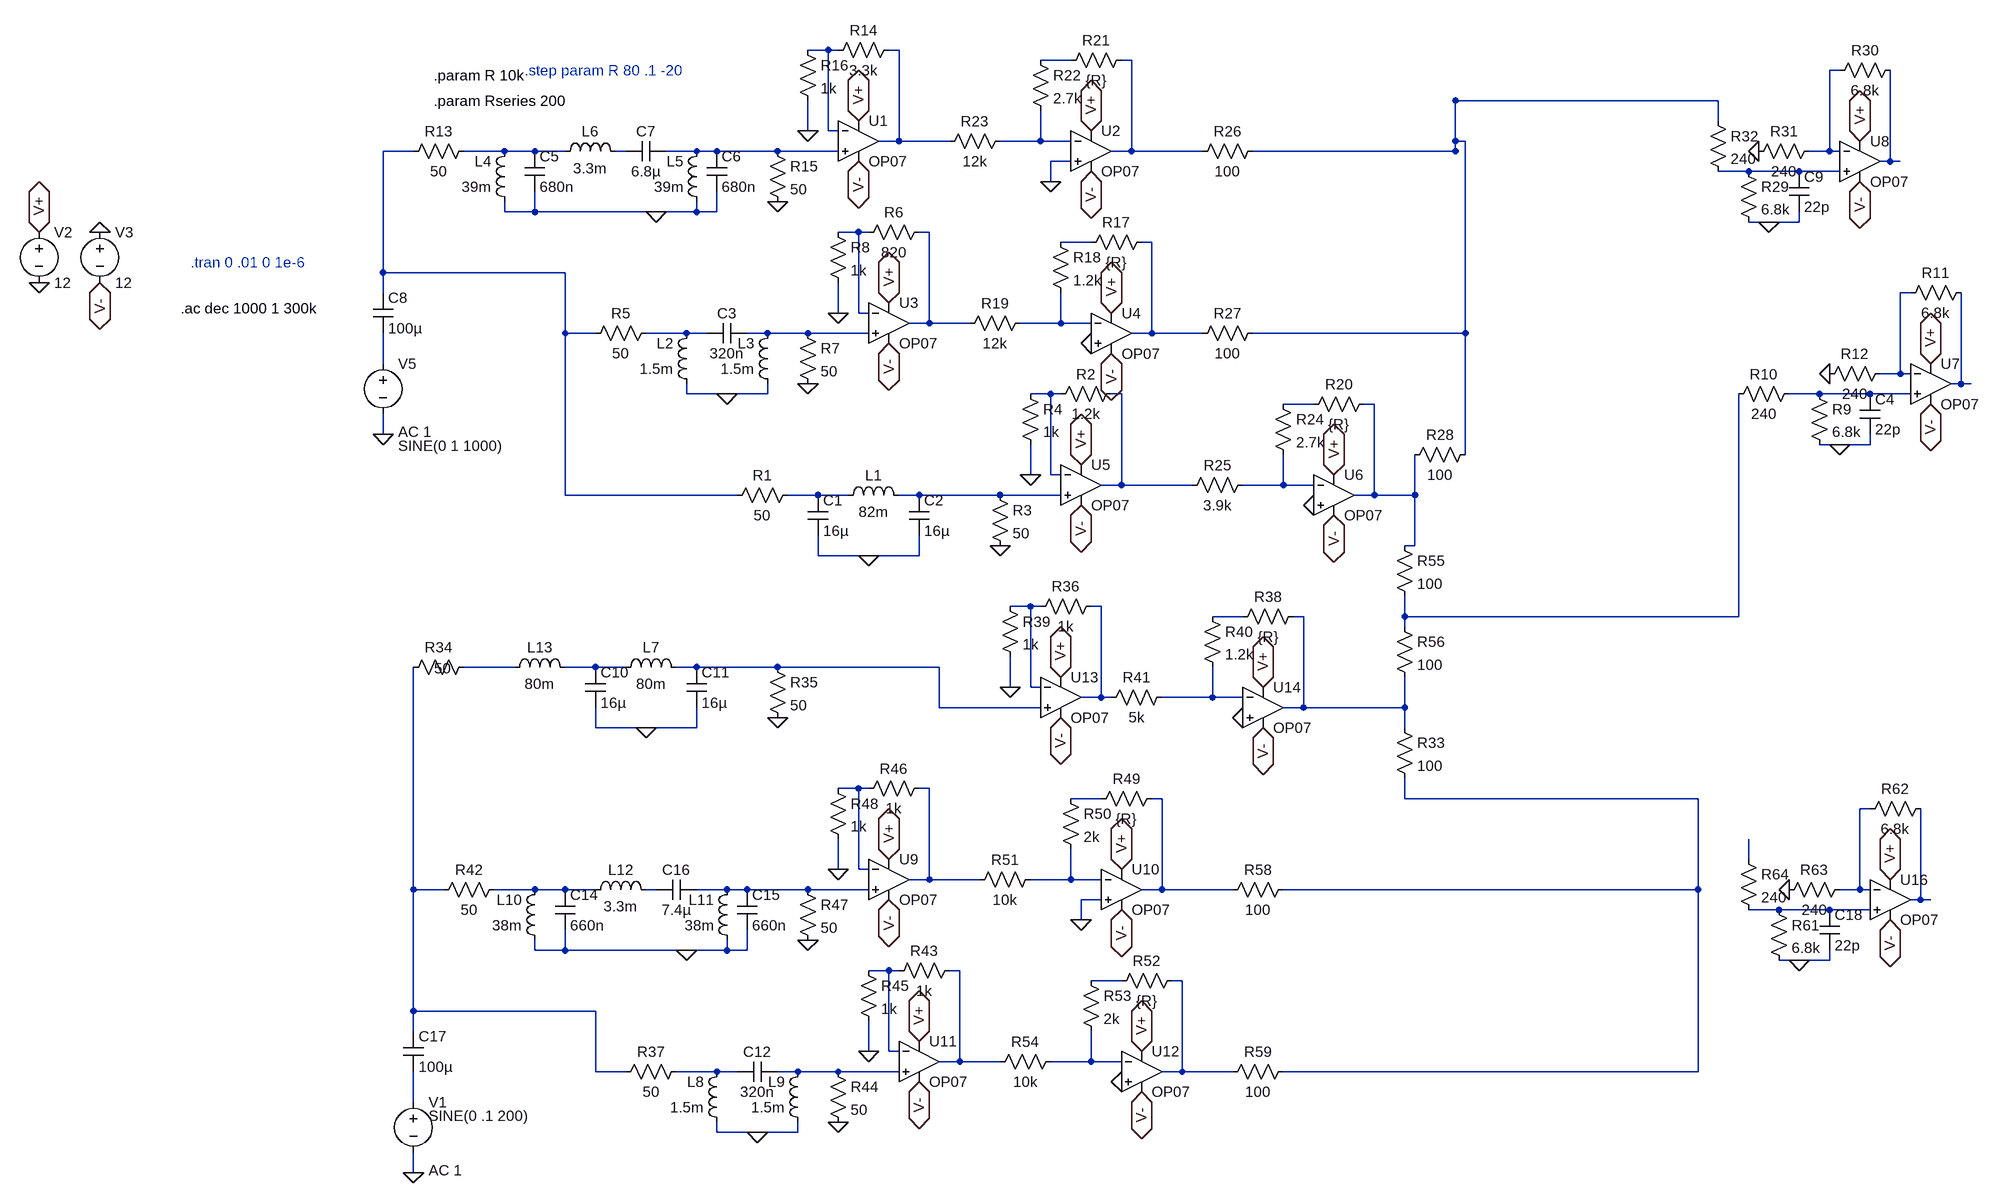
[diagram p0: schematic use_this_for_simulations_on_Mac_test_doubleBASS.asc]
use_this_for_simulations_on_Mac_test_doubleBASS.asc, the LTspice schematic file:
Version 4
SHEET 1 1632 1392
WIRE -192 -592 -224 -592
WIRE -176 -592 -192 -592
WIRE -80 -592 -96 -592
WIRE 192 -576 144 -576
WIRE 288 -576 272 -576
WIRE 1408 -560 1392 -560
WIRE 1216 -512 800 -512
WIRE 1216 -480 1216 -512
WIRE -224 -464 -224 -512
WIRE -192 -464 -192 -592
WIRE -176 -464 -192 -464
WIRE -80 -448 -80 -592
WIRE -80 -448 -112 -448
WIRE 0 -448 -80 -448
WIRE 144 -448 144 -496
WIRE 144 -448 80 -448
WIRE 192 -448 144 -448
WIRE 800 -448 800 -512
WIRE 816 -448 800 -448
WIRE -848 -432 -896 -432
WIRE -704 -432 -768 -432
WIRE -656 -432 -704 -432
WIRE -608 -432 -656 -432
WIRE -512 -432 -528 -432
WIRE -400 -432 -448 -432
WIRE -368 -432 -400 -432
WIRE -272 -432 -368 -432
WIRE -176 -432 -272 -432
WIRE 288 -432 288 -576
WIRE 288 -432 256 -432
WIRE 400 -432 288 -432
<<<<<<< Updated upstream
WIRE 800 -432 800 -448
=======
WIRE 800 -432 800 -512
>>>>>>> Stashed changes
WIRE 800 -432 480 -432
WIRE 1392 -432 1392 -560
WIRE 1392 -432 1360 -432
WIRE 1408 -432 1392 -432
WIRE 192 -416 160 -416
WIRE 1488 -416 1488 -560
WIRE 1488 -416 1472 -416
WIRE 1504 -416 1488 -416
WIRE 1264 -400 1216 -400
WIRE 1344 -400 1264 -400
WIRE 1408 -400 1344 -400
WIRE 160 -384 160 -416
WIRE -704 -336 -704 -352
WIRE -656 -336 -656 -368
WIRE -656 -336 -704 -336
WIRE -464 -336 -656 -336
WIRE -400 -336 -400 -352
WIRE -400 -336 -464 -336
WIRE -368 -336 -368 -368
WIRE -368 -336 -400 -336
WIRE 1296 -320 1264 -320
WIRE 1344 -320 1344 -336
WIRE 1344 -320 1296 -320
WIRE -144 -304 -176 -304
WIRE -128 -304 -144 -304
WIRE -32 -304 -48 -304
WIRE 224 -288 176 -288
WIRE 320 -288 304 -288
WIRE -896 -240 -896 -432
WIRE -608 -240 -896 -240
WIRE -896 -208 -896 -240
WIRE 1520 -208 1504 -208
WIRE -176 -176 -176 -224
WIRE -144 -176 -144 -304
WIRE -128 -176 -144 -176
WIRE -32 -160 -32 -304
WIRE -32 -160 -64 -160
WIRE 32 -160 -32 -160
WIRE 176 -160 176 -208
WIRE 176 -160 112 -160
WIRE 224 -160 176 -160
WIRE -608 -144 -608 -240
WIRE -560 -144 -608 -144
WIRE -416 -144 -480 -144
WIRE -384 -144 -416 -144
WIRE -288 -144 -320 -144
WIRE -224 -144 -288 -144
WIRE -128 -144 -224 -144
WIRE 320 -144 320 -288
WIRE 320 -144 288 -144
WIRE 400 -144 320 -144
WIRE 816 -144 816 -448
WIRE 816 -144 480 -144
WIRE -896 -96 -896 -144
WIRE 1504 -80 1504 -208
WIRE 1504 -80 1472 -80
WIRE 1520 -80 1504 -80
WIRE 1600 -64 1600 -208
WIRE 1600 -64 1584 -64
WIRE 1616 -64 1600 -64
WIRE -416 -48 -416 -64
WIRE -352 -48 -416 -48
WIRE -288 -48 -288 -64
WIRE -288 -48 -352 -48
WIRE 160 -48 128 -48
WIRE 176 -48 160 -48
WIRE 272 -48 256 -48
WIRE 1376 -48 1328 -48
WIRE 1456 -48 1376 -48
WIRE 1520 -48 1456 -48
WIRE 576 -32 528 -32
WIRE 672 -32 656 -32
WIRE -896 16 -896 -16
WIRE 1408 32 1376 32
WIRE 1456 32 1456 16
WIRE 1456 32 1408 32
WIRE 816 48 816 -144
WIRE 128 80 128 32
WIRE 160 80 160 -48
WIRE 176 80 160 80
WIRE 272 96 272 -48
WIRE 272 96 240 96
WIRE 384 96 272 96
WIRE 528 96 528 48
WIRE 528 96 464 96
WIRE 576 96 528 96
WIRE -608 112 -608 -144
WIRE -336 112 -608 112
WIRE -208 112 -256 112
WIRE -160 112 -208 112
WIRE -48 112 -80 112
WIRE 80 112 -48 112
WIRE 176 112 80 112
WIRE 672 112 672 -32
WIRE 672 112 640 112
WIRE 736 112 736 48
WIRE 736 112 672 112
WIRE 736 192 736 112
WIRE 736 192 720 192
WIRE -208 208 -208 176
WIRE -128 208 -208 208
WIRE -48 208 -48 176
WIRE -48 208 -128 208
WIRE 128 288 96 288
WIRE 144 288 128 288
WIRE 240 288 224 288
WIRE 464 304 416 304
WIRE 560 304 544 304
WIRE 720 304 720 272
WIRE 1248 304 1248 -48
WIRE 1248 304 720 304
WIRE 720 320 720 304
WIRE -688 384 -768 384
WIRE -560 384 -608 384
WIRE -512 384 -560 384
WIRE -400 384 -432 384
WIRE -272 384 -400 384
WIRE -16 384 -272 384
WIRE 96 416 96 368
WIRE 128 416 128 288
WIRE 144 416 128 416
WIRE 240 432 240 288
WIRE 240 432 208 432
WIRE 256 432 240 432
WIRE 416 432 416 384
WIRE 416 432 336 432
WIRE 464 432 416 432
WIRE -16 448 -16 384
WIRE 144 448 -16 448
WIRE 560 448 560 304
WIRE 560 448 528 448
WIRE 720 448 720 400
WIRE 720 448 560 448
WIRE -560 480 -560 448
WIRE -480 480 -560 480
WIRE -400 480 -400 448
WIRE -400 480 -480 480
WIRE 720 480 720 448
WIRE -144 576 -176 576
WIRE -128 576 -144 576
WIRE -32 576 -48 576
WIRE 240 592 192 592
WIRE 336 592 320 592
WIRE 720 592 720 560
WIRE 1184 592 720 592
WIRE 1456 608 1440 608
WIRE 1264 688 1264 656
WIRE -176 704 -176 656
WIRE -144 704 -144 576
WIRE -128 704 -144 704
WIRE -32 720 -32 576
WIRE -32 720 -64 720
WIRE 48 720 -32 720
WIRE 192 720 192 672
WIRE 192 720 128 720
WIRE 240 720 192 720
WIRE -848 736 -848 384
WIRE -800 736 -848 736
WIRE -656 736 -720 736
WIRE -608 736 -656 736
WIRE -560 736 -608 736
WIRE -464 736 -480 736
WIRE -352 736 -400 736
WIRE -320 736 -352 736
WIRE -224 736 -320 736
WIRE -128 736 -224 736
WIRE 336 736 336 592
WIRE 336 736 304 736
WIRE 448 736 336 736
WIRE 1184 736 1184 592
WIRE 1184 736 528 736
WIRE 1440 736 1440 608
WIRE 1440 736 1408 736
WIRE 1456 736 1440 736
WIRE 240 752 208 752
WIRE 1536 752 1536 608
WIRE 1536 752 1520 752
WIRE 1552 752 1536 752
WIRE 1312 768 1264 768
WIRE 1392 768 1312 768
WIRE 1456 768 1392 768
WIRE 208 784 208 752
WIRE -656 832 -656 816
WIRE -608 832 -608 800
WIRE -608 832 -656 832
WIRE -416 832 -608 832
WIRE -352 832 -352 816
WIRE -352 832 -416 832
WIRE -320 832 -320 800
WIRE -320 832 -352 832
WIRE 1344 848 1312 848
WIRE 1392 848 1392 832
WIRE 1392 848 1344 848
WIRE -96 864 -128 864
WIRE -80 864 -96 864
WIRE 16 864 0 864
WIRE 272 880 224 880
WIRE 368 880 352 880
WIRE -848 928 -848 736
WIRE -560 928 -848 928
WIRE -848 960 -848 928
WIRE -128 992 -128 944
WIRE -96 992 -96 864
WIRE -80 992 -96 992
WIRE 16 1008 16 864
WIRE 16 1008 -16 1008
WIRE 80 1008 16 1008
WIRE 224 1008 224 960
WIRE 224 1008 160 1008
WIRE 272 1008 224 1008
WIRE -560 1024 -560 928
WIRE -512 1024 -560 1024
WIRE -368 1024 -432 1024
WIRE -336 1024 -368 1024
WIRE -240 1024 -272 1024
WIRE -176 1024 -240 1024
WIRE -80 1024 -176 1024
WIRE 368 1024 368 880
WIRE 368 1024 336 1024
WIRE 448 1024 368 1024
WIRE 1184 1024 1184 736
WIRE 1184 1024 528 1024
WIRE -848 1072 -848 1024
WIRE -368 1120 -368 1104
WIRE -304 1120 -368 1120
WIRE -240 1120 -240 1104
WIRE -240 1120 -304 1120
WIRE -848 1184 -848 1152
FLAG -1440 -304 V+
IOPIN -1440 -304 BiDir
FLAG 208 64 V+
IOPIN 208 64 BiDir
FLAG -1344 -224 V-
IOPIN -1344 -224 BiDir
FLAG 208 128 V-
IOPIN 208 128 BiDir
FLAG -1344 -304 0
FLAG -1440 -224 0
FLAG -128 208 0
FLAG -352 -48 0
FLAG 1552 -96 V+
IOPIN 1552 -96 BiDir
FLAG 1552 -32 V-
IOPIN 1552 -32 BiDir
FLAG 1408 32 0
FLAG 1392 -80 0
FLAG -896 16 0
FLAG -464 -336 0
FLAG 80 192 0
FLAG -96 -192 V+
IOPIN -96 -192 BiDir
FLAG -96 -128 V-
IOPIN -96 -128 BiDir
FLAG -224 -64 0
FLAG -144 -480 V+
IOPIN -144 -480 BiDir
FLAG -144 -416 V-
IOPIN -144 -416 BiDir
FLAG -272 -352 0
FLAG 224 -464 V+
IOPIN 224 -464 BiDir
FLAG 224 -400 V-
IOPIN 224 -400 BiDir
FLAG 256 -176 V+
IOPIN 256 -176 BiDir
FLAG 256 -112 V-
IOPIN 256 -112 BiDir
FLAG 608 80 V+
IOPIN 608 80 BiDir
FLAG 608 144 V-
IOPIN 608 144 BiDir
FLAG 224 -128 0
FLAG 160 -384 0
FLAG 576 128 0
FLAG 1440 -448 V+
IOPIN 1440 -448 BiDir
FLAG 1440 -384 V-
IOPIN 1440 -384 BiDir
FLAG 1296 -320 0
FLAG 1280 -432 0
FLAG -304 1120 0
FLAG -848 1184 0
FLAG -416 832 0
FLAG -48 976 V+
IOPIN -48 976 BiDir
FLAG -48 1040 V-
IOPIN -48 1040 BiDir
FLAG -176 1104 0
FLAG -96 688 V+
IOPIN -96 688 BiDir
FLAG -96 752 V-
IOPIN -96 752 BiDir
FLAG -224 816 0
FLAG 272 704 V+
IOPIN 272 704 BiDir
FLAG 272 768 V-
IOPIN 272 768 BiDir
FLAG 304 992 V+
IOPIN 304 992 BiDir
FLAG 304 1056 V-
IOPIN 304 1056 BiDir
FLAG 272 1040 0
FLAG 208 784 0
FLAG 1488 720 V+
IOPIN 1488 720 BiDir
FLAG 1488 784 V-
IOPIN 1488 784 BiDir
FLAG 1344 848 0
FLAG 1328 736 0
FLAG -480 480 0
FLAG -272 464 0
FLAG 176 400 V+
IOPIN 176 400 BiDir
FLAG 176 464 V-
IOPIN 176 464 BiDir
FLAG 496 416 V+
IOPIN 496 416 BiDir
FLAG 496 480 V-
IOPIN 496 480 BiDir
FLAG 464 464 0
FLAG -128 992 0
FLAG -176 704 0
FLAG 96 416 0
FLAG -224 -464 0
FLAG -176 -176 0
FLAG 128 80 0
SYMBOL voltage -1440 -320 R0
WINDOW 123 0 0 Left 2
WINDOW 39 0 0 Left 2
SYMATTR InstName V2
SYMATTR Value 12
SYMBOL voltage -1344 -320 R0
WINDOW 123 0 0 Left 2
WINDOW 39 0 0 Left 2
SYMATTR InstName V3
SYMATTR Value 12
SYMBOL res -240 96 R90
WINDOW 0 0 56 VBottom 2
WINDOW 3 32 56 VTop 2
SYMATTR InstName R1
SYMATTR Value 50
SYMBOL res 272 -64 R90
WINDOW 0 0 56 VBottom 2
WINDOW 3 32 56 VTop 2
SYMATTR InstName R2
<<<<<<< Updated upstream
SYMATTR Value 1k
=======
SYMATTR Value 1.2k
>>>>>>> Stashed changes
SYMBOL cap -224 112 R0
SYMATTR InstName C1
SYMATTR Value 16µ
SYMBOL ind -176 128 R270
WINDOW 0 32 56 VTop 2
WINDOW 3 5 56 VBottom 2
SYMATTR InstName L1
<<<<<<< Updated upstream
SYMATTR Value 80m
SYMATTR SpiceLine Rser={Rseries}
=======
SYMATTR Value 82m
SYMATTR SpiceLine Rser=212
>>>>>>> Stashed changes
SYMBOL cap -64 112 R0
SYMATTR InstName C2
SYMATTR Value 16µ
SYMBOL res 64 96 R0
SYMATTR InstName R3
SYMATTR Value 50
SYMBOL res 112 -64 R0
SYMATTR InstName R4
SYMATTR Value 1k
SYMBOL res -464 -160 R90
WINDOW 0 0 56 VBottom 2
WINDOW 3 32 56 VTop 2
SYMATTR InstName R5
SYMATTR Value 50
SYMBOL cap -384 -128 R270
WINDOW 0 32 32 VTop 2
WINDOW 3 0 32 VBottom 2
SYMATTR InstName C3
SYMATTR Value 320n
SYMBOL ind -400 -48 R180
WINDOW 0 36 80 Left 2
WINDOW 3 36 40 Left 2
SYMATTR InstName L2
SYMATTR Value 1.5m
SYMATTR SpiceLine Rser=6.1
SYMBOL ind -272 -48 R180
WINDOW 0 36 80 Left 2
WINDOW 3 36 40 Left 2
SYMATTR InstName L3
SYMATTR Value 1.5m
SYMATTR SpiceLine Rser=6.1
SYMBOL cap 1440 -48 R0
SYMATTR InstName C4
SYMATTR Value 22p
SYMBOL res 1360 -64 R0
SYMATTR InstName R9
SYMATTR Value 6.8k
SYMBOL res 1232 -32 R270
WINDOW 0 32 56 VTop 2
WINDOW 3 0 56 VBottom 2
SYMATTR InstName R10
SYMATTR Value 240
SYMBOL res 1504 -192 R270
WINDOW 0 32 56 VTop 2
WINDOW 3 0 56 VBottom 2
SYMATTR InstName R11
SYMATTR Value 6.8k
SYMBOL res 1376 -64 R270
WINDOW 0 32 56 VTop 2
WINDOW 3 0 56 VBottom 2
SYMATTR InstName R12
SYMATTR Value 240
SYMBOL voltage -896 -112 R0
WINDOW 123 24 124 Left 2
WINDOW 39 0 0 Left 2
WINDOW 3 24 146 Left 2
SYMATTR Value2 AC 1
<<<<<<< Updated upstream
SYMATTR Value SINE(0 .1 200)
=======
SYMATTR Value SINE(0 1 1000)
>>>>>>> Stashed changes
SYMATTR InstName V5
SYMBOL res -752 -448 R90
WINDOW 0 0 56 VBottom 2
WINDOW 3 32 56 VTop 2
SYMATTR InstName R13
SYMATTR Value 50
SYMBOL ind -688 -336 R180
WINDOW 0 36 80 Left 2
WINDOW 3 36 40 Left 2
SYMATTR InstName L4
SYMATTR Value 39m
SYMATTR SpiceLine Rser=80
SYMBOL ind -384 -336 R180
WINDOW 0 36 80 Left 2
WINDOW 3 36 40 Left 2
SYMATTR InstName L5
SYMATTR Value 39m
SYMATTR SpiceLine Rser=80
SYMBOL cap -672 -432 R0
SYMATTR InstName C5
SYMATTR Value 680n
SYMBOL cap -384 -432 R0
SYMATTR InstName C6
SYMATTR Value 680n
SYMBOL ind -624 -416 R270
WINDOW 0 32 56 VTop 2
WINDOW 3 5 56 VBottom 2
SYMATTR InstName L6
SYMATTR Value 3.3m
SYMATTR SpiceLine Rser=13
SYMBOL cap -512 -416 R270
WINDOW 0 32 32 VTop 2
WINDOW 3 0 32 VBottom 2
SYMATTR InstName C7
SYMATTR Value 6.8µ
SYMBOL res -32 -320 R90
WINDOW 0 0 56 VBottom 2
WINDOW 3 32 56 VTop 2
SYMATTR InstName R6
SYMATTR Value 820
SYMBOL res -240 -160 R0
SYMATTR InstName R7
SYMATTR Value 50
SYMBOL res -192 -320 R0
SYMATTR InstName R8
SYMATTR Value 1k
SYMBOL res -80 -608 R90
WINDOW 0 0 56 VBottom 2
WINDOW 3 32 56 VTop 2
SYMATTR InstName R14
SYMATTR Value 3.3k
SYMBOL res -288 -448 R0
SYMATTR InstName R15
SYMATTR Value 50
SYMBOL res -240 -608 R0
SYMATTR InstName R16
SYMATTR Value 1k
SYMBOL res 288 -592 R90
WINDOW 0 0 56 VBottom 2
WINDOW 3 32 56 VTop 2
SYMATTR InstName R21
SYMATTR Value {R}
SYMBOL res 128 -592 R0
SYMATTR InstName R22
SYMATTR Value 2.7k
SYMBOL res -16 -432 R270
WINDOW 0 32 56 VTop 2
WINDOW 3 0 56 VBottom 2
SYMATTR InstName R23
SYMATTR Value 12k
SYMBOL res 320 -304 R90
WINDOW 0 0 56 VBottom 2
WINDOW 3 32 56 VTop 2
SYMATTR InstName R17
SYMATTR Value {R}
SYMBOL res 160 -304 R0
SYMATTR InstName R18
SYMATTR Value 1.2k
SYMBOL res 16 -144 R270
WINDOW 0 32 56 VTop 2
WINDOW 3 0 56 VBottom 2
SYMATTR InstName R19
SYMATTR Value 12k
SYMBOL res 672 -48 R90
WINDOW 0 0 56 VBottom 2
WINDOW 3 32 56 VTop 2
SYMATTR InstName R20
SYMATTR Value {R}
SYMBOL res 512 -48 R0
SYMATTR InstName R24
SYMATTR Value 2.7k
SYMBOL res 368 112 R270
WINDOW 0 32 56 VTop 2
WINDOW 3 0 56 VBottom 2
SYMATTR InstName R25
<<<<<<< Updated upstream
SYMATTR Value 10k
=======
SYMATTR Value 3.9k
>>>>>>> Stashed changes
SYMBOL res 384 -416 R270
WINDOW 0 32 56 VTop 2
WINDOW 3 0 56 VBottom 2
SYMATTR InstName R26
SYMATTR Value 100
SYMBOL res 384 -128 R270
WINDOW 0 32 56 VTop 2
WINDOW 3 0 56 VBottom 2
SYMATTR InstName R27
SYMATTR Value 100
SYMBOL res 720 64 R270
WINDOW 0 32 56 VTop 2
WINDOW 3 0 56 VBottom 2
SYMATTR InstName R28
SYMATTR Value 100
SYMBOL cap -912 -208 R0
SYMATTR InstName C8
SYMATTR Value 100µ
SYMBOL Opamps/OP07 -144 -512 R0
SYMATTR InstName U1
SYMBOL Opamps/OP07 224 -496 R0
SYMATTR InstName U2
SYMBOL Opamps/OP07 -96 -224 R0
SYMATTR InstName U3
SYMBOL Opamps/OP07 256 -208 R0
SYMATTR InstName U4
SYMBOL Opamps/OP07 208 32 R0
SYMATTR InstName U5
SYMBOL Opamps/OP07 608 48 R0
SYMATTR InstName U6
SYMBOL Opamps/OP07 1552 -128 R0
SYMATTR InstName U7
SYMBOL cap 1328 -400 R0
SYMATTR InstName C9
SYMATTR Value 22p
SYMBOL res 1248 -416 R0
SYMATTR InstName R29
SYMATTR Value 6.8k
SYMBOL res 1392 -544 R270
WINDOW 0 32 56 VTop 2
WINDOW 3 0 56 VBottom 2
SYMATTR InstName R30
SYMATTR Value 6.8k
SYMBOL res 1264 -416 R270
WINDOW 0 32 56 VTop 2
WINDOW 3 0 56 VBottom 2
SYMATTR InstName R31
SYMATTR Value 240
SYMBOL Opamps/OP07 1440 -480 R0
SYMATTR InstName U8
SYMBOL res 1200 -496 R0
SYMATTR InstName R32
SYMATTR Value 240
SYMBOL res -416 1008 R90
WINDOW 0 0 56 VBottom 2
WINDOW 3 32 56 VTop 2
SYMATTR InstName R37
SYMATTR Value 50
SYMBOL cap -336 1040 R270
WINDOW 0 32 32 VTop 2
WINDOW 3 0 32 VBottom 2
SYMATTR InstName C12
SYMATTR Value 320n
SYMBOL ind -352 1120 R180
WINDOW 0 36 80 Left 2
WINDOW 3 36 40 Left 2
SYMATTR InstName L8
SYMATTR Value 1.5m
SYMBOL ind -224 1120 R180
WINDOW 0 36 80 Left 2
WINDOW 3 36 40 Left 2
SYMATTR InstName L9
SYMATTR Value 1.5m
SYMBOL voltage -848 1056 R0
WINDOW 123 24 124 Left 2
WINDOW 39 0 0 Left 2
WINDOW 3 24 38 Left 2
SYMATTR Value2 AC 1
SYMATTR Value SINE(0 .1 200)
SYMATTR InstName V1
SYMBOL res -704 720 R90
WINDOW 0 0 56 VBottom 2
WINDOW 3 32 56 VTop 2
SYMATTR InstName R42
SYMATTR Value 50
SYMBOL ind -640 832 R180
WINDOW 0 36 80 Left 2
WINDOW 3 36 40 Left 2
SYMATTR InstName L10
SYMATTR Value 38m
SYMBOL ind -336 832 R180
WINDOW 0 36 80 Left 2
WINDOW 3 36 40 Left 2
SYMATTR InstName L11
SYMATTR Value 38m
SYMBOL cap -624 736 R0
SYMATTR InstName C14
SYMATTR Value 660n
SYMBOL cap -336 736 R0
SYMATTR InstName C15
SYMATTR Value 660n
SYMBOL ind -576 752 R270
WINDOW 0 32 56 VTop 2
WINDOW 3 5 56 VBottom 2
SYMATTR InstName L12
SYMATTR Value 3.3m
SYMBOL cap -464 752 R270
WINDOW 0 32 32 VTop 2
WINDOW 3 0 32 VBottom 2
SYMATTR InstName C16
SYMATTR Value 7.4µ
SYMBOL res 16 848 R90
WINDOW 0 0 56 VBottom 2
WINDOW 3 32 56 VTop 2
SYMATTR InstName R43
SYMATTR Value 1k
SYMBOL res -192 1008 R0
SYMATTR InstName R44
SYMATTR Value 50
SYMBOL res -144 848 R0
SYMATTR InstName R45
SYMATTR Value 1k
SYMBOL res -32 560 R90
WINDOW 0 0 56 VBottom 2
WINDOW 3 32 56 VTop 2
SYMATTR InstName R46
SYMATTR Value 1k
SYMBOL res -240 720 R0
SYMATTR InstName R47
SYMATTR Value 50
SYMBOL res -192 560 R0
SYMATTR InstName R48
SYMATTR Value 1k
SYMBOL res 336 576 R90
WINDOW 0 0 56 VBottom 2
WINDOW 3 32 56 VTop 2
SYMATTR InstName R49
SYMATTR Value {R}
SYMBOL res 176 576 R0
SYMATTR InstName R50
SYMATTR Value 2k
SYMBOL res 32 736 R270
WINDOW 0 32 56 VTop 2
WINDOW 3 0 56 VBottom 2
SYMATTR InstName R51
SYMATTR Value 10k
SYMBOL res 368 864 R90
WINDOW 0 0 56 VBottom 2
WINDOW 3 32 56 VTop 2
SYMATTR InstName R52
SYMATTR Value {R}
SYMBOL res 208 864 R0
SYMATTR InstName R53
SYMATTR Value 2k
SYMBOL res 64 1024 R270
WINDOW 0 32 56 VTop 2
WINDOW 3 0 56 VBottom 2
SYMATTR InstName R54
SYMATTR Value 10k
SYMBOL res 432 752 R270
WINDOW 0 32 56 VTop 2
WINDOW 3 0 56 VBottom 2
SYMATTR InstName R58
SYMATTR Value 100
SYMBOL res 432 1040 R270
WINDOW 0 32 56 VTop 2
WINDOW 3 0 56 VBottom 2
SYMATTR InstName R59
SYMATTR Value 100
SYMBOL cap -864 960 R0
SYMATTR InstName C17
SYMATTR Value 100µ
SYMBOL Opamps/OP07 -96 656 R0
SYMATTR InstName U9
SYMBOL Opamps/OP07 272 672 R0
SYMATTR InstName U10
SYMBOL Opamps/OP07 -48 944 R0
SYMATTR InstName U11
SYMBOL Opamps/OP07 304 960 R0
SYMATTR InstName U12
SYMBOL cap 1376 768 R0
SYMATTR InstName C18
SYMATTR Value 22p
SYMBOL res 1296 752 R0
SYMATTR InstName R61
SYMATTR Value 6.8k
SYMBOL res 1440 624 R270
WINDOW 0 32 56 VTop 2
WINDOW 3 0 56 VBottom 2
SYMATTR InstName R62
SYMATTR Value 6.8k
SYMBOL res 1312 752 R270
WINDOW 0 32 56 VTop 2
WINDOW 3 0 56 VBottom 2
SYMATTR InstName R63
SYMATTR Value 240
SYMBOL Opamps/OP07 1488 688 R0
SYMATTR InstName U16
SYMBOL res 1248 672 R0
SYMATTR InstName R64
SYMATTR Value 240
SYMBOL res 704 464 R0
SYMATTR InstName R33
SYMATTR Value 100
SYMBOL res -752 368 R90
WINDOW 0 0 56 VBottom 2
WINDOW 3 2 50 VTop 2
SYMATTR InstName R34
SYMATTR Value 50
SYMBOL cap -576 384 R0
SYMATTR InstName C10
SYMATTR Value 16µ
SYMBOL ind -528 400 R270
WINDOW 0 32 56 VTop 2
WINDOW 3 5 56 VBottom 2
SYMATTR InstName L7
SYMATTR Value 80m
SYMATTR SpiceLine Rser={Rseries}
SYMBOL cap -416 384 R0
SYMATTR InstName C11
SYMATTR Value 16µ
SYMBOL res -288 368 R0
SYMATTR InstName R35
SYMATTR Value 50
SYMBOL res 240 272 R90
WINDOW 0 0 56 VBottom 2
WINDOW 3 32 56 VTop 2
SYMATTR InstName R36
SYMATTR Value 1k
SYMBOL res 80 272 R0
SYMATTR InstName R39
SYMATTR Value 1k
SYMBOL Opamps/OP07 176 368 R0
SYMATTR InstName U13
SYMBOL res 560 288 R90
WINDOW 0 0 56 VBottom 2
WINDOW 3 32 56 VTop 2
SYMATTR InstName R38
SYMATTR Value {R}
SYMBOL res 400 288 R0
SYMATTR InstName R40
SYMATTR Value 1.2k
SYMBOL Opamps/OP07 496 384 R0
SYMATTR InstName U14
SYMBOL res 240 448 R270
WINDOW 0 32 56 VTop 2
WINDOW 3 0 56 VBottom 2
SYMATTR InstName R41
SYMATTR Value 5k
SYMBOL res 704 176 R0
SYMATTR InstName R55
SYMATTR Value 100
SYMBOL res 704 304 R0
SYMATTR InstName R56
SYMATTR Value 100
SYMBOL ind -704 400 R270
WINDOW 0 32 56 VTop 2
WINDOW 3 5 56 VBottom 2
SYMATTR InstName L13
SYMATTR Value 80m
SYMATTR SpiceLine Rser={Rseries}
TEXT -1216 -184 Left 2 !.ac dec 1000 1 300k
TEXT -672 -560 Left 2 ;.step param R 80 .1 -20
TEXT -816 -552 Left 2 !.param R 10k
TEXT -816 -512 Left 2 !.param Rseries 200
TEXT -1200 -256 Left 2 ;.tran 0 .01 0 1e-6

The netlist it stands for:
* use_this_for_simulations_on_Mac_test_doubleBASS.asc
V2 V+ 0 12
V3 0 V- 12
R1 N030 N008 50
R2 N025 N024 1.2k
C1 N030 0 16µ
L1 N030 N031 82m Rser=212
C2 N031 0 16µ
R3 N031 0 50
R4 N024 0 1k
R5 N020 N008 50
C3 N020 N021 320n
L2 0 N020 1.5m Rser=6.1
L3 0 N021 1.5m Rser=6.1
C4 N026 0 22p
R9 N026 0 6.8k
R10 N036 N026 240
R11 N018 N023 6.8k
R12 0 N018 240
V5 N022 0 SINE(0 1 1000) AC 1
R13 N009 N008 50
L4 0 N009 39m Rser=80
L5 0 N011 39m Rser=80
C5 N009 0 680n
C6 N011 0 680n
L6 N009 N010 3.3m Rser=13
C7 N010 N011 6.8µ
R6 N015 N014 820
R7 N021 0 50
R8 N014 0 1k
R14 N002 N001 3.3k
R15 N011 0 50
R16 N001 0 1k
R21 N004 N003 {R}
R22 N003 N007 2.7k
R23 N002 N007 12k
R17 N017 N016 {R}
R18 N016 N019 1.2k
R19 N015 N019 12k
R20 N028 N027 {R}
R24 N027 N029 2.7k
R25 N025 N029 3.9k
R26 N004 N006 100
R27 N017 N006 100
R28 N028 N006 100
C8 N008 N022 100µ
XU1 N011 N001 V+ V- N002 LT1001  ; OP07, pins In+ In- V+ V- OUT
XU2 0 N007 V+ V- N004 LT1001  ; OP07, pins In+ In- V+ V- OUT
XU3 N021 N014 V+ V- N015 LT1001  ; OP07, pins In+ In- V+ V- OUT
XU4 0 N019 V+ V- N017 LT1001  ; OP07, pins In+ In- V+ V- OUT
XU5 N031 N024 V+ V- N025 LT1001  ; OP07, pins In+ In- V+ V- OUT
XU6 0 N029 V+ V- N028 LT1001  ; OP07, pins In+ In- V+ V- OUT
XU7 N026 N018 V+ V- N023 LT1001  ; OP07, pins In+ In- V+ V- OUT
C9 N013 0 22p
R29 N013 0 6.8k
R30 N005 N012 6.8k
R31 0 N005 240
XU8 N013 N005 V+ V- N012 LT1001  ; OP07, pins In+ In- V+ V- OUT
R32 N006 N013 240
R37 N060 N049 50
C12 N060 N061 320n
L8 0 N060 1.5m
L9 0 N061 1.5m
V1 N062 0 SINE(0 .1 200) AC 1
R42 N050 N049 50
L10 0 N050 38m
L11 0 N052 38m
C14 N050 0 660n
C15 N052 0 660n
L12 N050 N051 3.3m
C16 N051 N052 7.4µ
R43 N056 N055 1k
R44 N061 0 50
R45 N055 0 1k
R46 N042 N041 1k
R47 N052 0 50
R48 N041 0 1k
R49 N044 N043 {R}
R50 N043 N048 2k
R51 N042 N048 10k
R52 N058 N057 {R}
R53 N057 N059 2k
R54 N056 N059 10k
R58 N044 N045 100
R59 N058 N045 100
C17 N049 N062 100µ
XU9 N052 N041 V+ V- N042 LT1001  ; OP07, pins In+ In- V+ V- OUT
XU10 0 N048 V+ V- N044 LT1001  ; OP07, pins In+ In- V+ V- OUT
XU11 N061 N055 V+ V- N056 LT1001  ; OP07, pins In+ In- V+ V- OUT
XU12 0 N059 V+ V- N058 LT1001  ; OP07, pins In+ In- V+ V- OUT
C18 N054 0 22p
R61 N054 0 6.8k
R62 N046 N053 6.8k
R63 0 N046 240
XU16 N054 N046 V+ V- N053 LT1001  ; OP07, pins In+ In- V+ V- OUT
R64 N047 N054 240
R33 N035 N045 100
R34 N037 N049 50
C10 N038 0 16µ
L7 N038 N039 80m Rser={Rseries}
C11 N039 0 16µ
R35 N039 0 50
R36 N033 N032 1k
R39 N032 0 1k
XU13 N039 N032 V+ V- N033 LT1001  ; OP07, pins In+ In- V+ V- OUT
R38 N035 N034 {R}
R40 N034 N040 1.2k
XU14 0 N040 V+ V- N035 LT1001  ; OP07, pins In+ In- V+ V- OUT
R41 N033 N040 5k
R55 N028 N036 100
R56 N036 N035 100
L13 N037 N038 80m Rser={Rseries}
.ac dec 1000 1 300k
* .step param R 80 .1 -20
.param R 10k
.param Rseries 200
* .tran 0 .01 0 1e-6
.lib LTC.lib
.backanno
.end